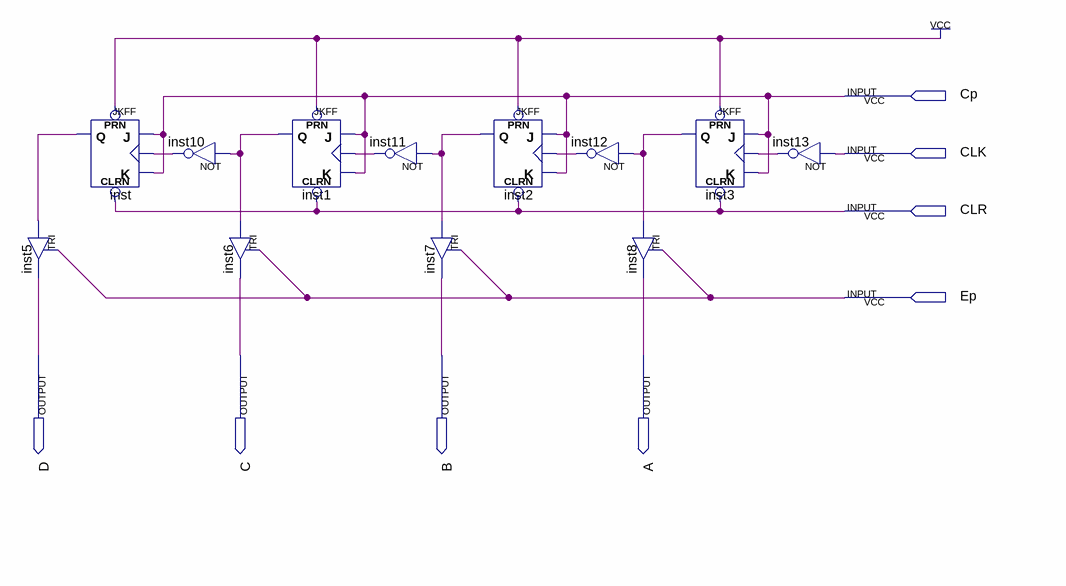
[diagram p0: schematic sheet]
// Quartus schematic program_counter.bdf as structural Verilog: 12 symbols, 8 pins
module program_counter (
  input  Cp,
  input  CLK,
  input  CLR,
  input  Ep,
  output D,
  output C,
  output B,
  output A
);

  wire inst1_q, inst2_q, inst3_q, inst10_out, inst11_out, inst12_out, inst13_out, inst_q;

  TRI inst5 (.IN(inst_q), .OE(Ep), .OUT(D));
  JKFF inst (.PRN(1'b1), .CLRN(CLR), .K(Cp), .J(Cp), .CLK(inst10_out), .Q(inst_q));
  not inst10 (inst10_out, inst1_q);
  TRI inst6 (.IN(inst1_q), .OE(Ep), .OUT(C));
  JKFF inst1 (.PRN(1'b1), .CLRN(CLR), .K(Cp), .J(Cp), .CLK(inst11_out), .Q(inst1_q));
  not inst11 (inst11_out, inst2_q);
  JKFF inst2 (.PRN(1'b1), .CLRN(CLR), .K(Cp), .J(Cp), .CLK(inst12_out), .Q(inst2_q));
  TRI inst7 (.IN(inst2_q), .OE(Ep), .OUT(B));
  not inst12 (inst12_out, inst3_q);
  TRI inst8 (.IN(inst3_q), .OE(Ep), .OUT(A));
  JKFF inst3 (.PRN(1'b1), .CLRN(CLR), .K(Cp), .J(Cp), .CLK(inst13_out), .Q(inst3_q));
  not inst13 (inst13_out, CLK);
endmodule
